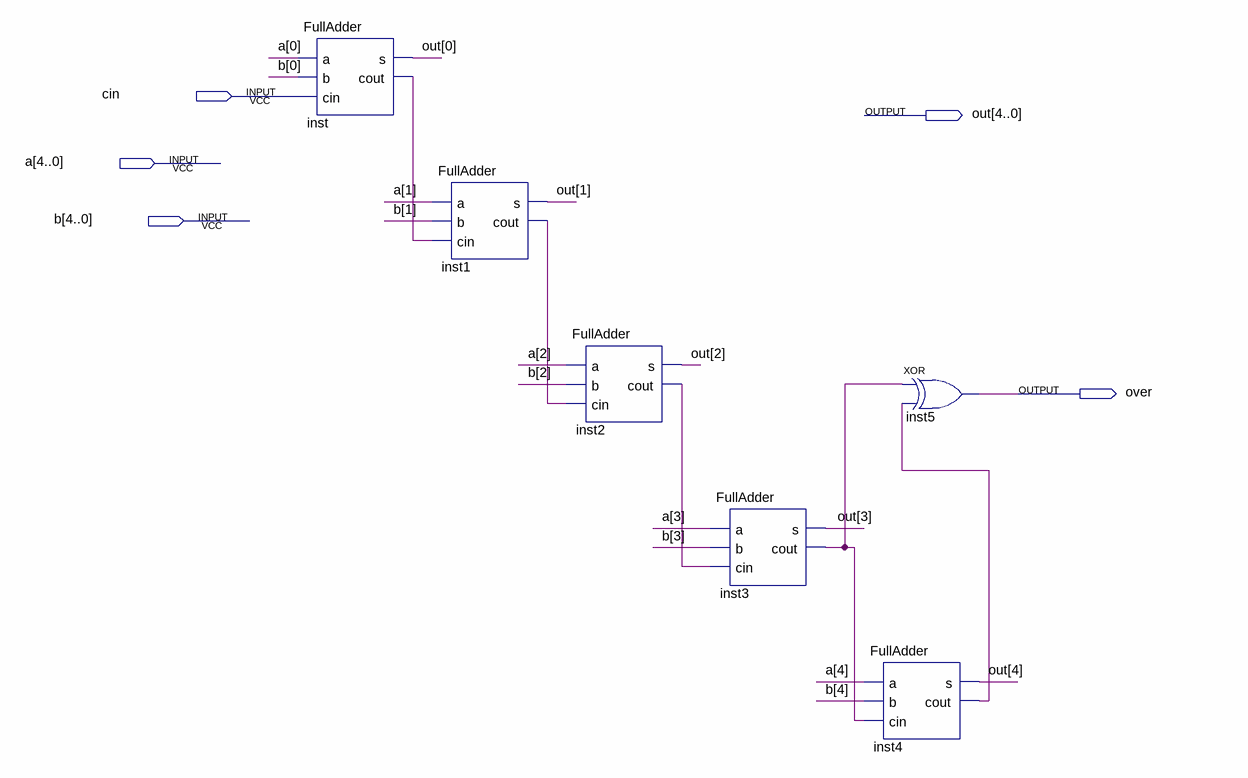
[diagram p0: schematic sheet]
// Quartus schematic adder_5.bdf as structural Verilog: 6 symbols, 5 pins
module adder_5 (
  input  cin,
  input  [4:0] a,
  input  [4:0] b,
  output [4:0] out,
  output over
);

  wire inst1_cout, inst2_cout, inst3_cout, inst4_cout, inst_cout;

  FullAdder inst (.a(a[0]), .b(b[0]), .cin(cin), .s(out[0]), .cout(inst_cout));
  FullAdder inst1 (.a(a[1]), .b(b[1]), .cin(inst_cout), .s(out[1]), .cout(inst1_cout));
  FullAdder inst2 (.a(a[2]), .b(b[2]), .cin(inst1_cout), .s(out[2]), .cout(inst2_cout));
  FullAdder inst3 (.a(a[3]), .b(b[3]), .cin(inst2_cout), .s(out[3]), .cout(inst3_cout));
  FullAdder inst4 (.a(a[4]), .b(b[4]), .cin(inst3_cout), .s(out[4]), .cout(inst4_cout));
  xor inst5 (over, inst3_cout, inst4_cout);
endmodule
